# Altium schematic sheet IR.SchDoc
size Tabloid; SheetNumber: 1; SheetTotal: 1
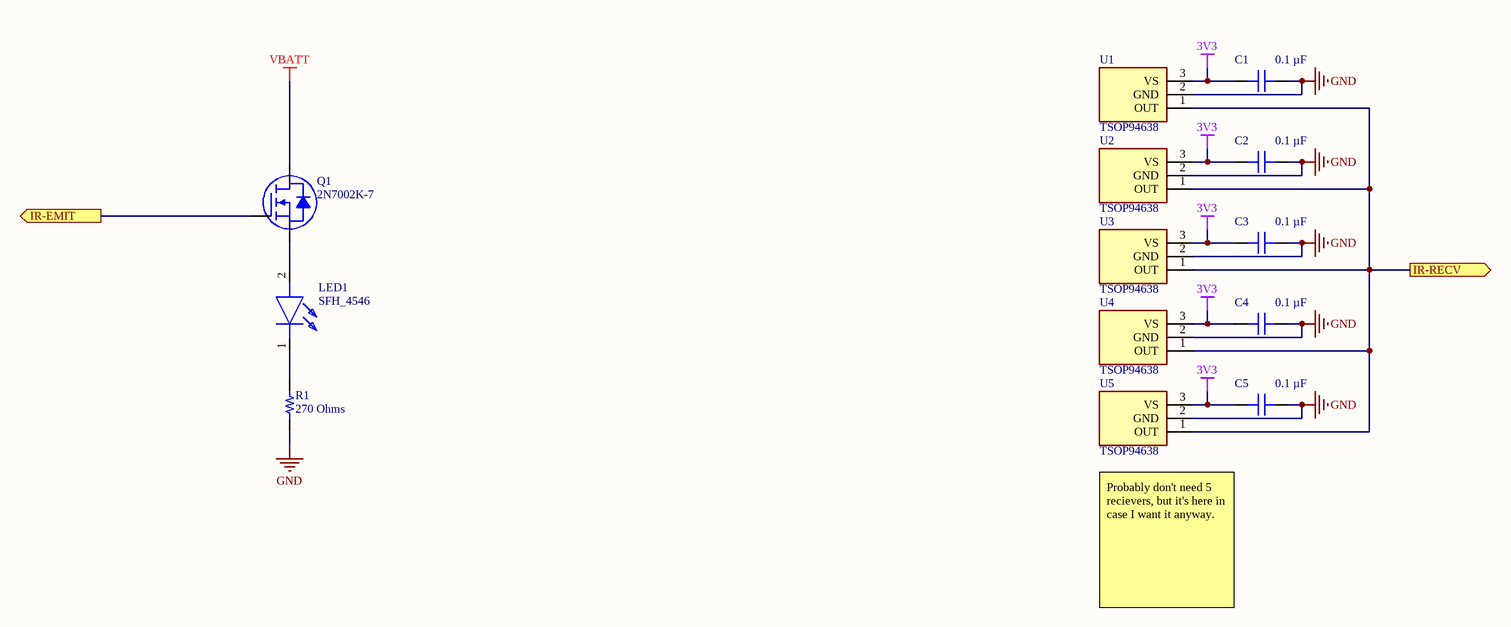
[diagram p0: IR.SchDoc]

## Parts
C1  0.1 µF  [CAP 0805_2012]
C2  0.1 µF  [CAP 0805_2012]
C3  0.1 µF  [CAP 0805_2012]
C4  0.1 µF  [CAP 0805_2012]
C5  0.1 µF  [CAP 0805_2012]
LED1  SFH_4546  [SFH_4556P]
Q1  2N7002K-7  [DIODES SOT-23-3]
R1  270 Ohms  [RES 0805_2012]
U1  TSOP94638  [TSOP94638]
U2  TSOP94638  [TSOP94638]
U3  TSOP94638  [TSOP94638]
U4  TSOP94638  [TSOP94638]
U5  TSOP94638  [TSOP94638]

## Ports
IR-EMIT (out), IR-RECV (out)

## Nets
3V3: C1.2 C2.2 C3.2 C4.2 C5.2 U1.3(VS) U2.3(VS) U3.3(VS) U4.3(VS) U5.3(VS)
GND: C1.1 C2.1 C3.1 C4.1 C5.1 R1.1 U1.2(GND) U2.2(GND) U3.2(GND) U4.2(GND) U5.2(GND)
VBATT: Q1.3(D)
IR-EMIT: Q1.1(G) ; port IR-EMIT
IR-RECV: U1.1(OUT) U2.1(OUT) U3.1(OUT) U4.1(OUT) U5.1(OUT) ; port IR-RECV
NetLED1_1: LED1.1(K) R1.2
NetLED1_2: LED1.2(A) Q1.2(S)

## Notes on the sheet
- (near U5) Probably don't need 5 recievers, but it's here in case I want it anyway.
- Insert really cool logo here
- Really_Cool_Title:
- Revision:
- Desciption:
- Version:
- Engineer:

## Library data of the parts
C1-C5 = 0805B104K250CT: CAP CER 0.1UF 25V X7R 0805; manufacturer: Walsin Technology Corporation; Tolerance: ±10%; Part Number: 0805B104K250CT; Capacitance: 0.1 µF; Applications: General Purpose; componentlink1description: Datasheet; componentlink1url: http://www.passivecomponent.com/wp-content/uploads/2018/10/MLCC.pdf; componentlink2description: DigiKey Link; componentlink2url: https://www.digikey.com/en/products/detail/walsin-technology-corporation/0805B104K250CT/9355063; Device Package: 0805 (2012 Metric); lastupdated: 2/9/2024 8:16:02 PM; Lifecycle Status: Active; Minimum Order: 1; Mounting Type: Surface Mount, MLCC; Operating Temperature: -55°C ~ 125°C; Package / Case: 0805 (2012 Metric); packaging: TapeAndReel; partid: 4879; Part Status: Active; price: 0.01; series: -; Size / Dimension: 0.079" L x 0.049" W (2.00mm x 1.25mm); Supplier 1: DigiKey; Supplier Part Number 1: 1292-1566-1-ND; Temperature Coefficient: X7R; Thickness (Max): 0.035" (0.90mm); value: 0.1 µF; Voltage - Rated: 25V
LED1 = SFH_4546: LED; Manufacturer_Name: ams OSRAM; Datasheet Link: https://datasheet.datasheetarchive.com/originals/distributors/DKDS41/DSANUWW0036912.pdf; Manufacturer_Part_Number: SFH 4546; Mouser Part Number: 720-SFH4546; Mouser Price/Stock: https://www.mouser.co.uk/ProductDetail/OSRAM-Opto-Semiconductors/SFH-4546?qs=VcOkZLzzauarreCVxaCHEQ%3D%3D
Q1 = 2N7002K-7: MOSFET N-CH 60V 380MA SOT23-3; Manufacturer: Diodes Incorporated; Current - Continuous Drain (Id) @ 25°C: 380mA (Ta); Drive Voltage (Max Rds On,  Min Rds On): 5V, 10V; FET Type: N-Channel; Gate Charge (Qg) (Max) @ Vgs: 0.3 nC @ 4.5 V; Input Capacitance (Ciss) (Max) @ Vds: 50 pF @ 25 V; Power Dissipation (Max): 370mW (Ta); Rds On (Max) @ Id, Vgs: 2Ohm @ 500mA, 10V; Vgs (Max): ±20V; Vgs(th) (Max) @ Id: 2.5V @ 1mA; Part Number: 2N7002K-7; ComponentLink1Description: Datasheet; ComponentLink1URL: https://www.diodes.com/assets/Datasheets/ds30896.pdf; ComponentLink2Description: DigiKey Link; ComponentLink2URL: https://www.digikey.com/en/products/detail/diodes-incorporated/2N7002K-7/1934378; Drain to Source Voltage (Vdss): 60 V; LastUpdated: 6/3/2024 8:15:18 PM; Lifecycle Status: Active; Minimum Order: 1; Mounting Type: Surface Mount; Operating Temperature: -55°C ~ 150°C (TJ); Package / Case: TO-236-3, SC-59, SOT-23-3; Packaging: TapeAndReel; Part Status: Active; Price: 0.02; Series: -; Supplier 1: DigiKey; Supplier Part Number 1: 2N7002K-7DICT-ND; Supplier Device Package: SOT-23-3; Technology: MOSFET (Metal Oxide)
R1 = CRG0805F270R: RES SMD 270 OHM 1% 1/8W 0805; Manufacturer: TE Connectivity Passive Product; Power (Watts): 0.125W, 1/8W; Temperature Coefficient: ±100ppm/°C; Part Number: CRG0805F270R; Value: 270 Ohms; ComponentLink1Description: Datasheet; ComponentLink1URL: https://www.te.com/commerce/DocumentDelivery/DDEController?Action=srchrtrv&DocNm=1773204&DocType=DS&DocLang=English; ComponentLink2Description: DigiKey Link; ComponentLink2URL: https://www.digikey.com/en/products/detail/te-connectivity-passive-product/CRG0805F270R/2380878; Composition: Thick Film; Device Package: 0805 (2012 Metric); Height - Seated (Max): 0.026" (0.65mm); LastUpdated: 2/8/2024 9:02:34 PM; Lifecycle Status: Active; Minimum Order: 1; Number of Terminations: 2; Operating Temperature: -55°C ~ 155°C; Package / Case: 0805 (2012 Metric); Packaging: TapeAndReel; PartId: 28942; Part Status: Active; Price: 0.01; Resistance: 270 Ohms; Series: CRG, Neohm; Size / Dimension: 0.079" L x 0.049" W (2.00mm x 1.25mm); Supplier 1: DigiKey; Supplier Part Number 1: A126355CT-ND; Supplier Device Package: 0805; Tolerance: ±1%
U1-U5 = TSOP94638: Integrated Circuit; Manufacturer_Name: Vishay; Datasheet Link: https://www.vishay.com/docs/82836/tsop946.pdf; Height: 10.45mm; Manufacturer_Part_Number: TSOP94638; Mouser Part Number: 78-TSOP94638; Mouser Price/Stock: https://www.mouser.co.uk/ProductDetail/Vishay-Semiconductors/TSOP94638?qs=byeeYqUIh0Mp1x6QgpoyDQ%3D%3D; Arrow Part Number: TSOP94638; Arrow Price/Stock: https://www.arrow.com/en/products/tsop94638/vishay